# EAGLE design zeta2rework_lw_v27_rework (EAGLE 9.0.1)
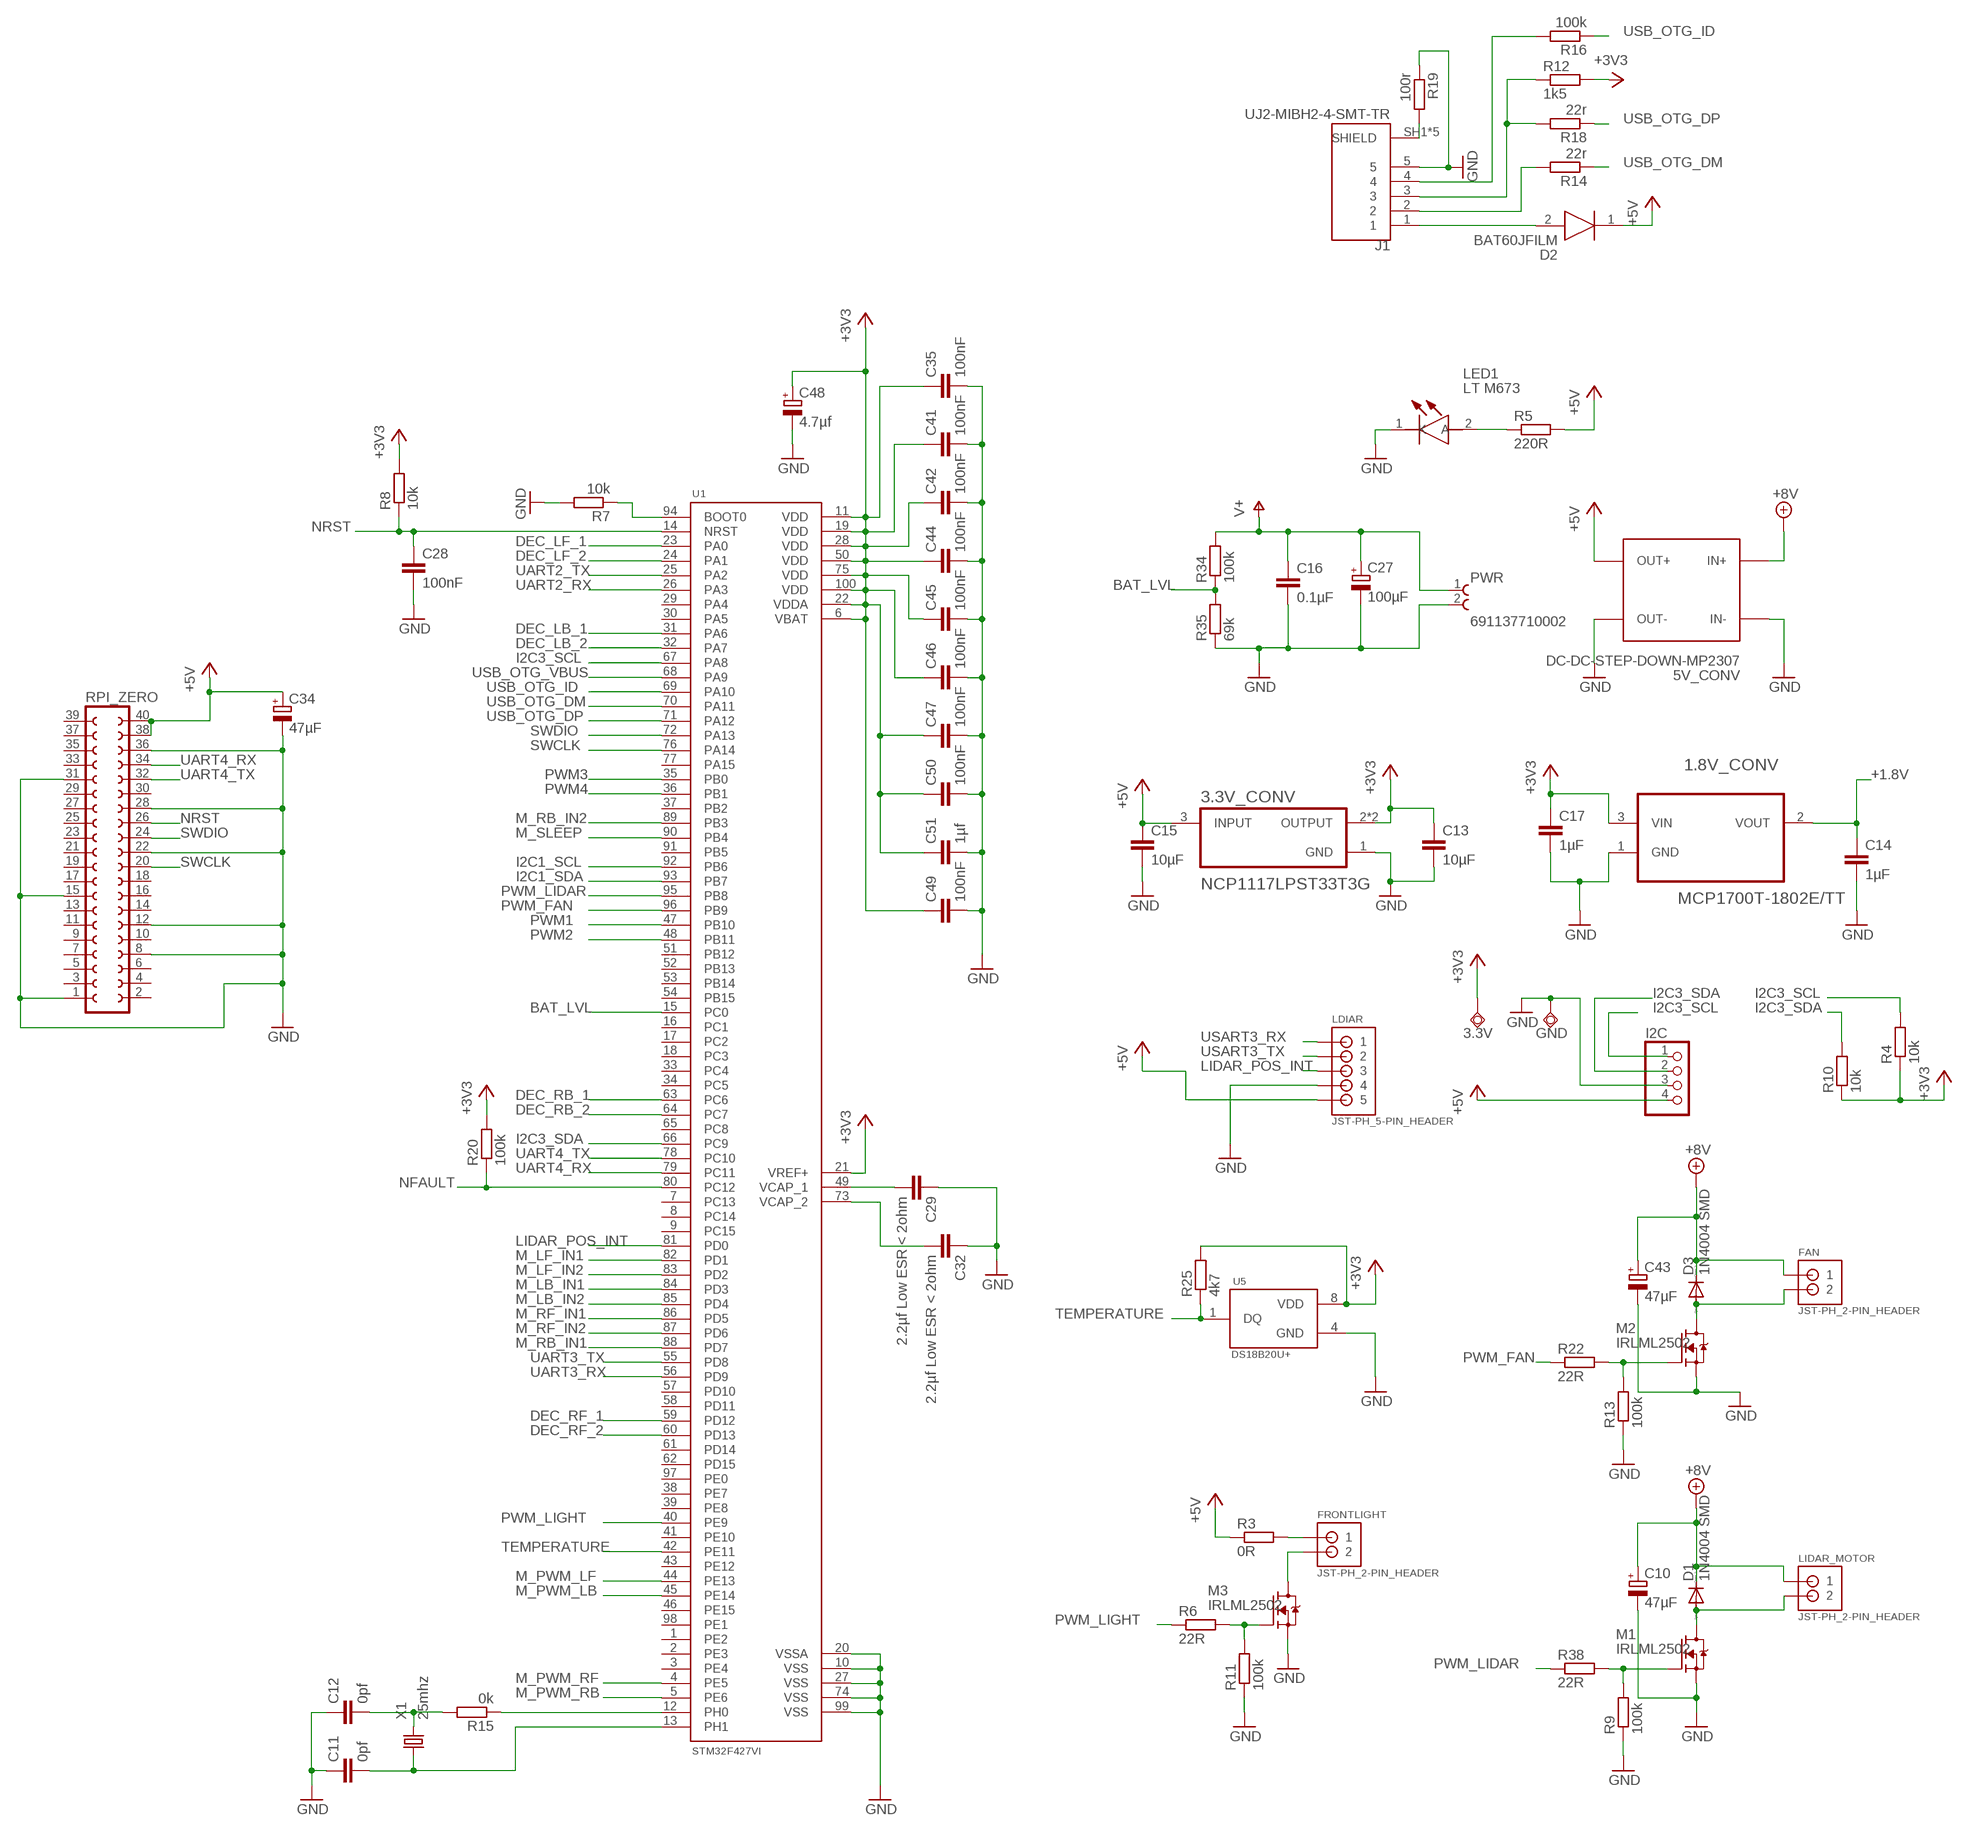
[diagram p0: schematic, sheet 1, part 1 of 2]
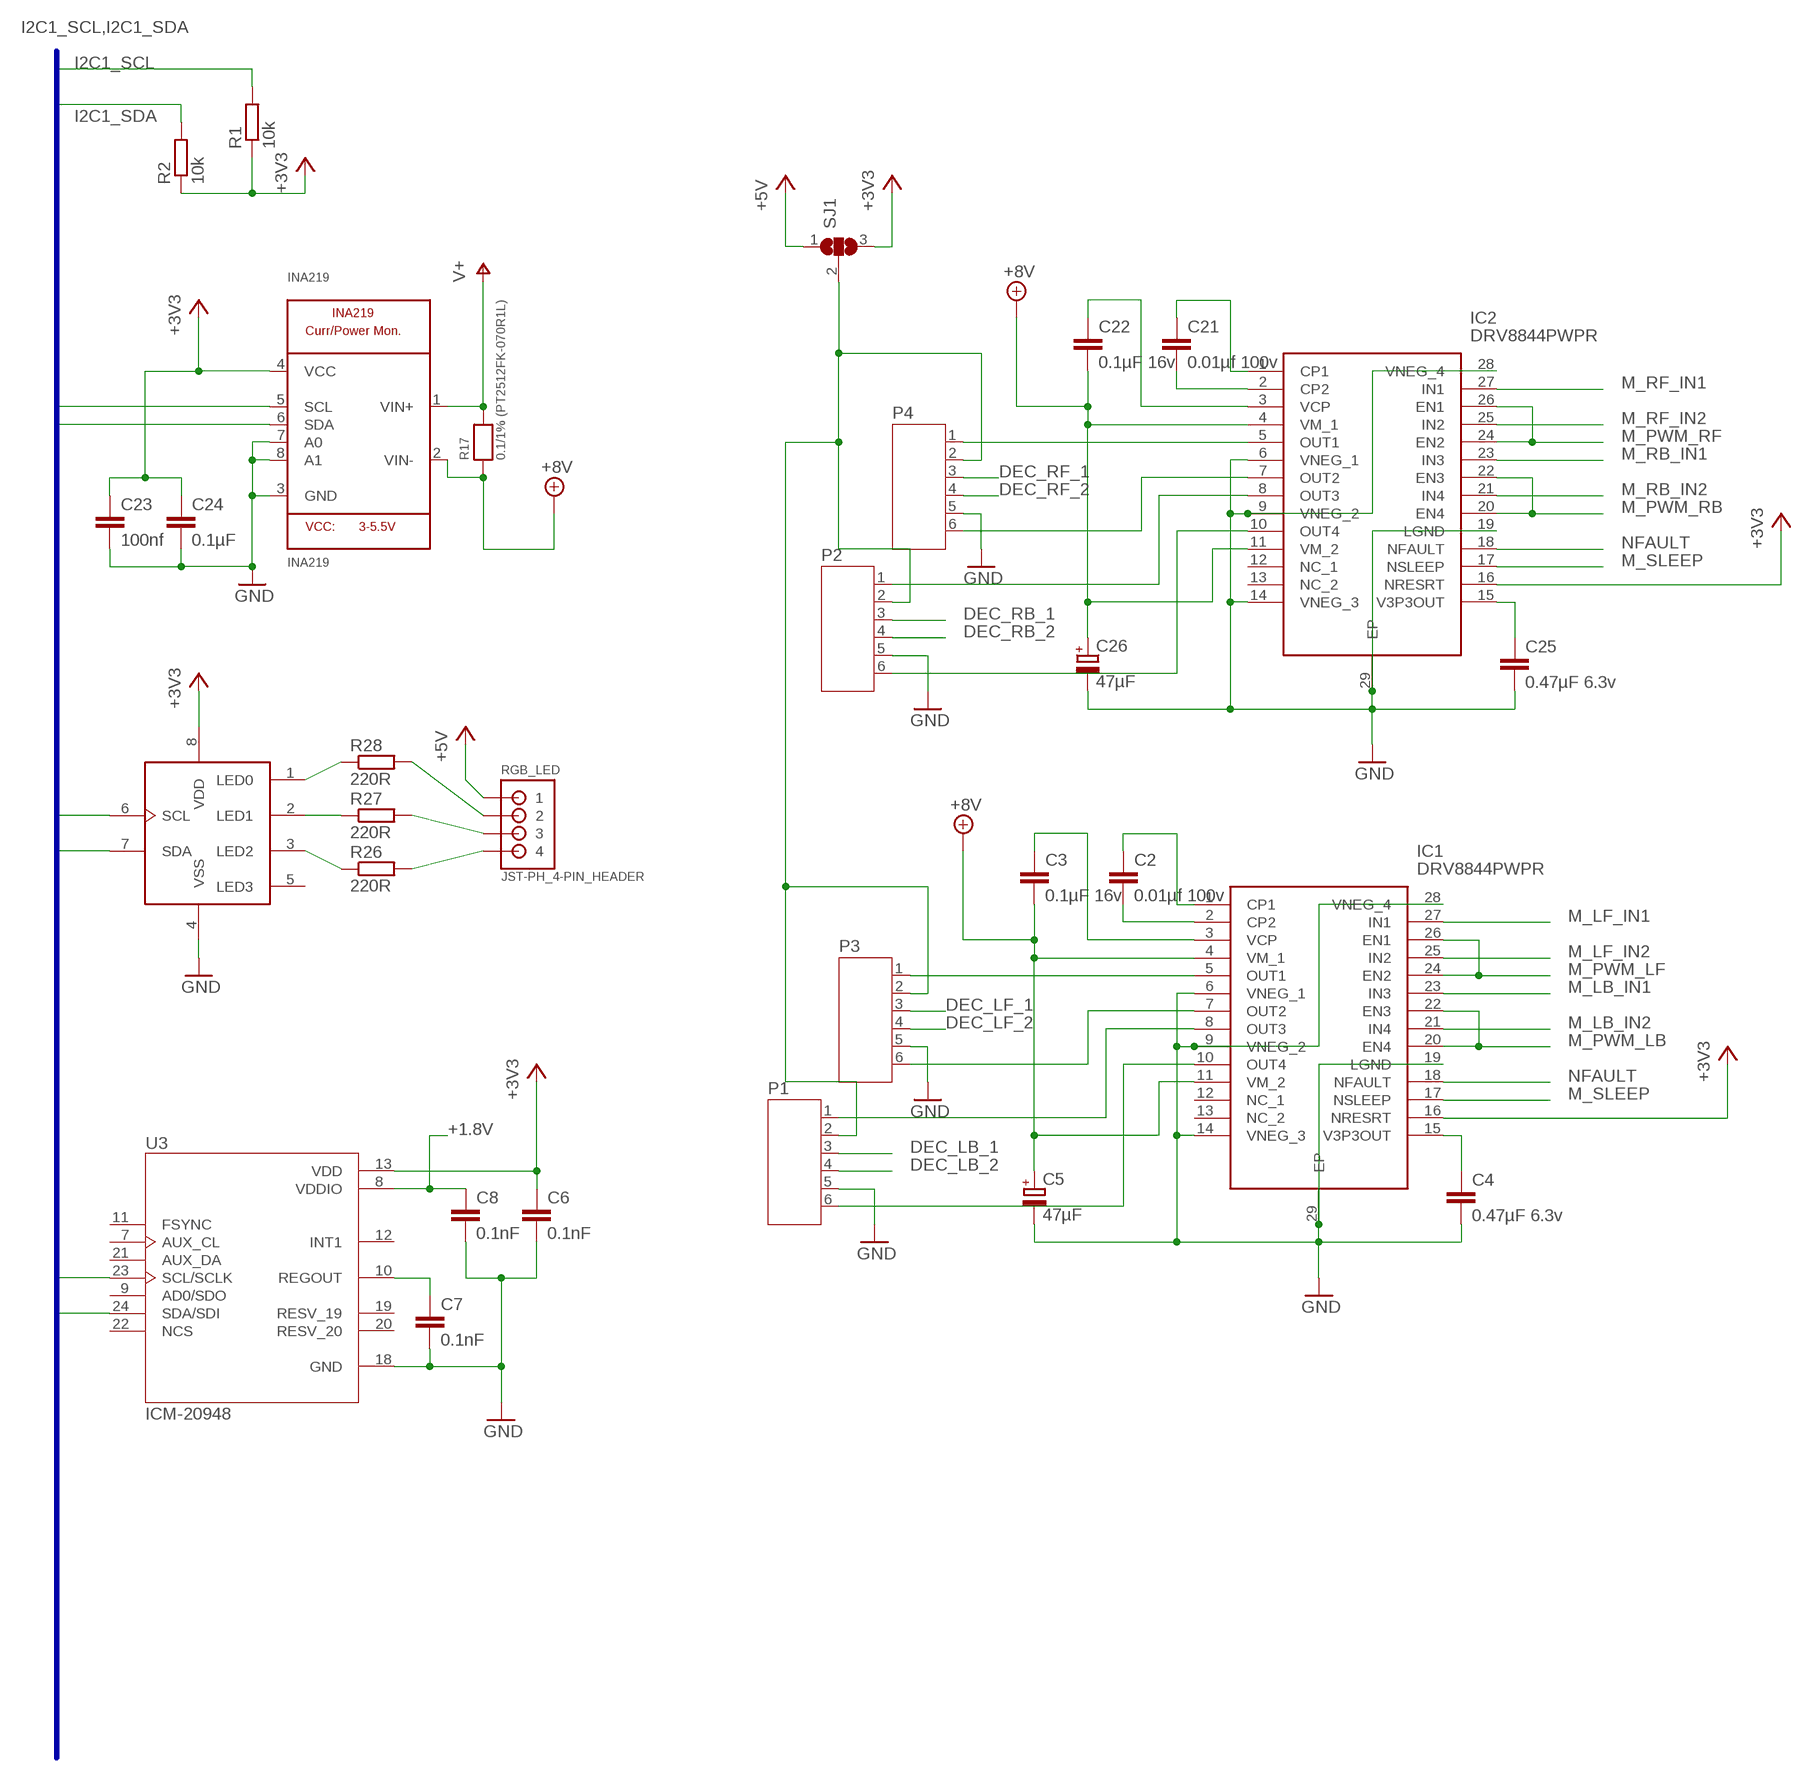
[diagram p1: schematic, sheet 1, part 2 of 2]

## Parts
1.8V_CONV  MCP1700T-1802E/TT  MCP1700T-2102E/TT  [SOT95P237X112-3N]
3.3V  TPSQTP20R  [TP20R]
3.3V_CONV  NCP1117LPST33T3G  [SOT230P700X175-4N]
5V_CONV  DC-DC-STEP-DOWN-MP2307  [DC-DC-STEP-DOWN-MP2307]
C2  0.01µf 100v  C-EUC1206  [C1206]
C3  0.1µF 16v  C-EUC1206  [C1206]
C4  0.47µF 6.3v  C-EUC1206  [C1206]
C5  47µF  CPOL-EUUD-5X5,8  [UD-5X5,8_NICHICON]
C6  0.1nF  C-EUC0603  [C0603]
C7  0.1nF  C-EUC1206  [C1206]
C8  0.1nF  C-EUC1206  [C1206]
C10  47µF  CPOL-EUUD-5X5,8  [UD-5X5,8_NICHICON]
C11  0pf  C-EUC1206  [C1206]
C12  0pf  C-EUC1206  [C1206]
C13  10µF  C-EUC1206  [C1206]
C14  1µF  C-EUC1206  [C1206]
C15  10µF  C-EUC1206  [C1206]
C16  0.1µF  C-EUC1206  [C1206]
C17  1µF  C-EUC1206  [C1206]
C21  0.01µf 100v  C-EUC1206  [C1206]
C22  0.1µF 16v  C-EUC1206  [C1206]
C23  100nf  C-EUC1206  [C1206]
C24  0.1µF  C-EUC1206  [C1206]
C25  0.47µF 6.3v  C-EUC1206  [C1206]
C26  47µF  CPOL-EUUD-5X5,8  [UD-5X5,8_NICHICON]
C27  100µF  CPOL-EUUD-5X5,8  [UD-5X5,8_NICHICON]
C28  100nF  C-EUC1206  [C1206]
C29  2.2µf Low ESR < 2ohm  C-EUC1206  [C1206]
C32  2.2µf Low ESR < 2ohm  C-EUC1206  [C1206]
C34  47µF  CPOL-EUUD-5X5,8  [UD-5X5,8_NICHICON]
C35  100nF  C-EUC1206  [C1206]
C41  100nF  C-EUC1206  [C1206]
C42  100nF  C-EUC1206  [C1206]
C43  47µF  CPOL-EUUD-5X5,8  [UD-5X5,8_NICHICON]
C44  100nF  C-EUC1206  [C1206]
C45  100nF  C-EUC1206  [C1206]
C46  100nF  C-EUC1206  [C1206]
C47  100nF  C-EUC1206  [C1206]
C48  4.7µf  CPOL-EUSMCP  [SMC_P]
C49  100nF  C-EUC1206  [C1206]
C50  100nF  C-EUC1206  [C1206]
C51  1µf  C-EUC1206  [C1206]
D1  1N4004 SMD  DIODE-DO214AC  [DO214AC]
D2  BAT60JFILM  [SOD2513X117N]
D3  1N4004 SMD  DIODE-DO214AC  [DO214AC]
FAN  JST-PH_2-PIN_HEADER  [JST_B2B-PH_HEADER]
FRONTLIGHT  JST-PH_2-PIN_HEADER  [JST_B2B-PH_HEADER]
GND  TPSQTP20R  [TP20R]
I2C  PINHD-1X4  [1X04]
IC1  DRV8844PWPR  [SOP65P640X120-29N]
IC2  DRV8844PWPR  [SOP65P640X120-29N]
INA219  INA219  [SOT23-8]
J1  UJ2-MIBH2-4-SMT-TR  [CUI_UJ2-MIBH2-4-SMT-TR]
LDIAR  JST-PH_5-PIN_HEADER  [JST_B5B-PH_HEADER]
LED1  LT M673  LT_M673-N1R2-25  [LTM673-N1R2-25]
LIDAR_MOTOR  JST-PH_2-PIN_HEADER  [JST_B2B-PH_HEADER]
M1  IRLML2502  IRLML2502TRPBF  [SOT23]
M2  IRLML2502  IRLML2502TRPBF  [SOT23]
M3  IRLML2502  IRLML2502TRPBF  [SOT23]
P1  JST-PH6  [JST-PH6]
P2  JST-PH6  [JST-PH6]
P3  JST-PH6  [JST-PH6]
P4  JST-PH6  [JST-PH6]
PCA9533  PCA9533  [SOIC8]
PWR  691137710002  [691137710002]
R1  10k  R-EU_R0603  [R0603]
R2  10k  R-EU_R0603  [R0603]
R3  0R  R-EU_R0603  [R0603]
R4  10k  R-EU_R0603  [R0603]
R5  220R  R-EU_R0603  [R0603]
R6  22R  R-EU_R0603  [R0603]
R7  10k  R-EU_R0603  [R0603]
R8  10k  R-EU_R0603  [R0603]
R9  100k  R-EU_R0603  [R0603]
R10  10k  R-EU_R0603  [R0603]
R11  100k  R-EU_R0603  [R0603]
R12  1k5  R-EU_R0603  [R0603]
R13  100k  R-EU_R0603  [R0603]
R14  22r  R-EU_R0603  [R0603]
R15  0k  R-EU_R0603  [R0603]
R16  100k  R-EU_R0603  [R0603]
R17  0.1/1% (PT2512FK-070R1L)  RESISTOR2512  [2512]
R18  22r  R-EU_R0603  [R0603]
R19  100r  R-EU_R0603  [R0603]
R20  100k  R-EU_R0603  [R0603]
R22  22R  R-EU_R0603  [R0603]
R25  4k7  R-EU_R0603  [R0603]
R26  220R  R-EU_R0603  [R0603]
R27  220R  R-EU_R0603  [R0603]
R28  220R  R-EU_R0603  [R0603]
R34  100k  R-EU_R0603  [R0603]
R35  69k  R-EU_R0603  [R0603]
R38  22R  R-EU_R0603  [R0603]
RGB_LED  JST-PH_4-PIN_HEADER  [JST_B4B-PH_HEADER]
RPI_ZERO  FE20-2  [FE20-2]
SJ1  SJ2W  [SJ_2]
U1  STM32F427VI  STM32F427VGT7  [QFP50P1600X1600X160-100N]
U3  ICM-20948  [QFN40P300X300X105-25N]
U5  DS18B20U+  [SOP65P490X95-8N]
X1  25mhz  KX-9A  [5.0X3.2_KX-9A]

## Nets
+1.8V: 1.8V_CONV.2(VOUT) C8.1 C14.1 U3.8(VDDIO)
+3V3: 1.8V_CONV.3(VIN) 3.3V.TP 3.3V_CONV.2(OUTPUT) 3.3V_CONV.4(OUTPUT) C6.1 C13.1 C17.1 C23.1 C24.1 C35.1 C41.1 C42.1 C44.1 C45.1 C46.1 C47.1 C48.+ C49.1 C50.1 C51.1 IC1.16(NRESRT) IC2.16(NRESRT) INA219.4(VCC) PCA9533.8(VDD) R1.1 R2.1 R4.1 R8.2 R10.1 R12.2 R20.2 R25.2 SJ1.3 U1.6(VBAT) U1.11(VDD) U1.19(VDD) U1.21(VREF+) U1.22(VDDA) U1.28(VDD) U1.50(VDD) U1.75(VDD) U1.100(VDD) U3.13(VDD) U5.8(VDD)
+5V: 3.3V_CONV.3(INPUT) 5V_CONV.OUT+ C15.1 C34.+ D2.1(K) I2C.4 LDIAR.P5 R3.1 R5.2 RGB_LED.P1 RPI_ZERO.38 RPI_ZERO.40 SJ1.1
+8V: 5V_CONV.IN+ C3.2 C5.+ C10.+ C22.2 C26.+ C43.+ D1.C D3.C FAN.P1 IC1.4(VM_1) IC1.11(VM_2) IC2.4(VM_1) IC2.11(VM_2) INA219.2(VIN-) LIDAR_MOTOR.P1 R17.1
BAT_LVL: R34.1 R35.2 U1.15(PC0)
DEC_LB_1: P1.3 U1.31(PA6)
DEC_LB_2: P1.4 U1.32(PA7)
DEC_LF_1: P3.3 U1.23(PA0)
DEC_LF_2: P3.4 U1.24(PA1)
DEC_RB_1: P2.3 U1.63(PC6)
DEC_RB_2: P2.4 U1.64(PC7)
DEC_RF_1: P4.3 U1.59(PD12)
DEC_RF_2: P4.4 U1.60(PD13)
GND: 1.8V_CONV.1(GND) 3.3V_CONV.1(GND) 5V_CONV.IN- 5V_CONV.OUT- C4.2 C5.- C6.2 C7.2 C8.2 C10.- C11.1 C12.1 C13.2 C14.2 C15.2 C16.2 C17.2 C23.2 C24.2 C25.2 C26.- C27.- C28.2 C29.1 C32.1 C34.- C35.2 C41.2 C42.2 C43.- C44.2 C45.2 C46.2 C47.2 C48.- C49.2 C50.2 C51.2 GND.TP I2C.3 IC1.6(VNEG_1) IC1.9(VNEG_2) IC1.14(VNEG_3) IC1.19(LGND) IC1.28(VNEG_4) IC1.29(EP) IC2.6(VNEG_1) IC2.9(VNEG_2) IC2.14(VNEG_3) IC2.19(LGND) IC2.28(VNEG_4) IC2.29(EP) INA219.3(GND) INA219.7(A0) INA219.8(A1) J1.5 LDIAR.P4 LED1.1(K) M1.2(S) M2.2(S) M3.2(S) P1.5 P2.5 P3.5 P4.5 PCA9533.4(VSS) PWR.2 R7.2 R9.1 R11.1 R13.1 R19.1 R35.1 RPI_ZERO.1 RPI_ZERO.8 RPI_ZERO.12 RPI_ZERO.15 RPI_ZERO.22 RPI_ZERO.28 RPI_ZERO.31 RPI_ZERO.36 U1.10(VSS) U1.20(VSSA) U1.27(VSS) U1.74(VSS) U1.99(VSS) U3.18(GND) U5.4(GND)
I2C1_SCL: INA219.5(SCL) PCA9533.6(SCL) R1.2 U1.92(PB6) U3.23(SCL/SCLK)
I2C1_SDA: INA219.6(SDA) PCA9533.7(SDA) R2.2 U1.93(PB7) U3.24(SDA/SDI)
I2C3_SCL: I2C.1 R4.2 U1.67(PA8)
I2C3_SDA: I2C.2 R10.2 U1.66(PC9)
LIDAR_POS_INT: LDIAR.P3 U1.81(PD0)
M_LB_IN1: IC1.23(IN3) U1.84(PD3)
M_LB_IN2: IC1.21(IN4) U1.85(PD4)
M_LF_IN1: IC1.27(IN1) U1.82(PD1)
M_LF_IN2: IC1.25(IN2) U1.83(PD2)
M_PWM_LB: IC1.20(EN4) IC1.22(EN3) U1.45(PE14)
M_PWM_LF: IC1.24(EN2) IC1.26(EN1) U1.44(PE13)
M_PWM_RB: IC2.20(EN4) IC2.22(EN3) U1.5(PE6)
M_PWM_RF: IC2.24(EN2) IC2.26(EN1) U1.4(PE5)
M_RB_IN1: IC2.23(IN3) U1.88(PD7)
M_RB_IN2: IC2.21(IN4) U1.89(PB3)
M_RF_IN1: IC2.27(IN1) U1.86(PD5)
M_RF_IN2: IC2.25(IN2) U1.87(PD6)
M_SLEEP: IC1.17(NSLEEP) IC2.17(NSLEEP) U1.90(PB4)
N$1: C21.2 IC2.2(CP2)
N$2: C21.1 IC2.1(CP1)
N$3: C22.1 IC2.3(VCP)
N$4: IC2.10(OUT4) P2.6
N$5: J1.3 R12.1 R18.2
N$6: FRONTLIGHT.P1 R3.2
N$7: LED1.2(A) R5.1
N$8: C7.1 U3.10(REGOUT)
N$9: FRONTLIGHT.P2 M3.3(D)
N$10: M3.1(G) R6.2 R11.2
N$11: IC2.5(OUT1) P4.1
N$12: IC2.7(OUT2) P4.6
N$13: C11.2 U1.13(PH1) X1.1
N$14: C12.2 R15.2 X1.3
N$15: D2.2(A) J1.1
N$16: R7.1 U1.94(BOOT0)
N$17: J1.4 R16.2
N$18: C2.2 IC1.2(CP2)
N$19: IC2.8(OUT3) P2.1
N$20: C2.1 IC1.1(CP1)
N$21: C3.1 IC1.3(VCP)
N$22: PCA9533.3(LED2) R26.1
N$23: PCA9533.2(LED1) R27.1
N$24: PCA9533.1(LED0) R28.1
N$25: IC1.5(OUT1) P3.1
N$26: C25.1 IC2.15(V3P3OUT)
N$27: IC1.7(OUT2) P3.6
N$28: IC1.8(OUT3) P1.1
N$29: C4.1 IC1.15(V3P3OUT)
N$30: IC1.10(OUT4) P1.6
N$31: R26.2 RGB_LED.P4
N$32: P1.2 P2.2 P3.2 P4.2 SJ1.2
N$33: R27.2 RGB_LED.P3
N$34: J1.2 R14.2
N$35: R28.2 RGB_LED.P2
N$36: C29.2 U1.49(VCAP_1)
N$37: M2.1(G) R13.2 R22.2
N$38: M1.1(G) R9.2 R38.2
N$39: D1.A LIDAR_MOTOR.P2 M1.3(D)
N$40: J1.SH1(SHIELD) J1.SH2(SHIELD) J1.SH3(SHIELD) J1.SH4(SHIELD) J1.SH5(SHIELD) R19.2
N$44: R15.1 U1.12(PH0)
N$45: C32.2 U1.73(VCAP_2)
N$55: D3.A FAN.P2 M2.3(D)
NFAULT: IC1.18(NFAULT) IC2.18(NFAULT) R20.1 U1.80(PC12)
NRST: C28.1 R8.1 RPI_ZERO.26 U1.14(NRST)
PWM1: U1.47(PB10)
PWM2: U1.48(PB11)
PWM3: U1.35(PB0)
PWM4: U1.36(PB1)
PWM_FAN: R22.1 U1.96(PB9)
PWM_LIDAR: R38.1 U1.95(PB8)
PWM_LIGHT: R6.1 U1.40(PE9)
SWCLK: RPI_ZERO.20 U1.76(PA14)
SWDIO: RPI_ZERO.24 U1.72(PA13)
TEMPERATURE: R25.1 U1.42(PE11) U5.1(DQ)
UART2_RX: U1.26(PA3)
UART2_TX: U1.25(PA2)
UART3_RX: U1.56(PD9)
UART3_TX: U1.55(PD8)
UART4_RX: RPI_ZERO.34 U1.79(PC11)
UART4_TX: RPI_ZERO.32 U1.78(PC10)
USART3_RX: LDIAR.P1
USART3_TX: LDIAR.P2
USB_OTG_DM: R14.1 U1.70(PA11)
USB_OTG_DP: R18.1 U1.71(PA12)
USB_OTG_ID: R16.1 U1.69(PA10)
USB_OTG_VBUS: U1.68(PA9)
V+: C16.1 C27.+ INA219.1(VIN+) PWR.1 R17.2 R34.2
Unconnected: IC1.12(NC_1) IC1.13(NC_2) IC2.12(NC_1) IC2.13(NC_2) PCA9533.5(LED3) RPI_ZERO.2 RPI_ZERO.3 RPI_ZERO.4 RPI_ZERO.5 RPI_ZERO.6 RPI_ZERO.7 RPI_ZERO.9 RPI_ZERO.10 RPI_ZERO.11 RPI_ZERO.13 RPI_ZERO.14 RPI_ZERO.16 RPI_ZERO.17 RPI_ZERO.18 RPI_ZERO.19 RPI_ZERO.21 RPI_ZERO.23 RPI_ZERO.25 RPI_ZERO.27 RPI_ZERO.29 RPI_ZERO.30 RPI_ZERO.33 RPI_ZERO.35 RPI_ZERO.37 RPI_ZERO.39 U1.1(PE2) U1.2(PE3) U1.3(PE4) U1.7(PC13) U1.8(PC14) U1.9(PC15) U1.16(PC1) U1.17(PC2) U1.18(PC3) U1.29(PA4) U1.30(PA5) U1.33(PC4) U1.34(PC5) U1.37(PB2) U1.38(PE7) U1.39(PE8) U1.41(PE10) U1.43(PE12) U1.46(PE15) U1.51(PB12) U1.52(PB13) U1.53(PB14) U1.54(PB15) U1.57(PD10) U1.58(PD11) U1.61(PD14) U1.62(PD15) U1.65(PC8) U1.77(PA15) U1.91(PB5) U1.97(PE0) U1.98(PE1) U3.7(AUX_CL) U3.9(AD0/SDO) U3.11(FSYNC) U3.12(INT1) U3.19(RESV_19) U3.20(RESV_20) U3.21(AUX_DA) U3.22(NCS)

## Buses
I2C1_SCL,I2C1_SDA

## Library data of the parts
1.8V_CONV = MCP1700T-2102E_TT:MCP1700T-2102E/TT: Low Quiescent Current LDO; AVAILABILITY: Unavailable; DESCRIPTION: 250mA CMOS LDO, Isupply 1uA and 2% VoutAccuracy; MF: Microchip; MP: MCP1700T-2102E/TT; PACKAGE: SOT-23 Microchip; PRICE: None
3.3V GND = testpad:TPSQ: Test pad
3.3V_CONV = NCP1117LPST33T3G:NCP1117LPST33T3G: None; AVAILABILITY: Unavailable; DESCRIPTION: Linear Voltage Regulator, Positive, LDO, 1.0 A _Fixed and Adjustable_ Vout: 3.3 V; MF: ON Semiconductor; MP: NCP1117LPST33T3G; PACKAGE: SOT-223 ON Semiconductor; PRICE: None
5V_CONV = diy-modules:DC-DC-STEP-DOWN-MP2307: DC/DC Step-Down Regulator based on MP2307DN chip MP2307 datasheet available here: https://cdn-shop.adafruit.com/datasheets/MP2307_r1.9.pdf Click here to find device on ebay.com <http://www.ebay.com/sch/dc+dc+3a+mini+converter>
C2-C4 C6-C8 C11-C17 C21-C25 C28 C29 C32 C35 C41 C42 C44-C47 C49-C51 = rcl:C-EU: CAPACITOR, European symbol; SPICEPREFIX: C
C5 C10 C26 C27 C34 C43 C48 = rcl:CPOL-EU: POLARIZED CAPACITOR, European symbol; SPICEPREFIX: C
D1 D3 = diode:DIODE-: DIODE
D2 = BAT60JFILM:BAT60JFILM: BAT60JFILM, Schottky Diode, 3A max, 10V, 2-Pin, SOD-323 Source: Datasheet <http://www.st.com/web/en/resource/technical/document/datasheet/CD00001944.pdf>; ALLIED_NUMBER: 70389806; ALLIED_PRICE-STOCK: http://www.alliedelec.com/stmicroelectronics-bat60jfilm/70389806/; DESCRIPTION: BAT60JFILM, Schottky Diode, 3A max, 10V, 2-Pin, SOD-323; HEIGHT: 1.17mm; MANUFACTURER_NAME: STMicroelectronics; MANUFACTURER_PART_NUMBER: BAT60JFILM; MOUSER_PART_NUMBER: 511-BAT60JFILM; MOUSER_PRICE-STOCK: https://www.mouser.com/Search/Refine.aspx?Keyword=511-BAT60JFILM; RS_PART_NUMBER: 1458781; RS_PRICE-STOCK: http://uk.rs-online.com/web/p/products/1458781
FAN FRONTLIGHT LIDAR_MOTOR = srg:JST-PH_2-PIN_HEADER: 2-pin JST PH Shrouded Header, top entry P/N B2B-PH-K-S Mating connector PHR-2 Mating cable assembly: Sparkfun PRT-09914 <http://www.sparkfun.com/products/9914>
I2C = pinhead:PINHD-1X4: PIN HEADER
IC1 IC2 = DRV8844PWPR:DRV8844PWPR: 5A Brushed DC motor or Quad 1.75A Solenoid/Relay Driver with +/-30V split supply support (PWM Ctrl) Source: Datasheet <http://www.ti.com/lit/ds/symlink/drv8844.pdf>; DESCRIPTION: 5A Brushed DC motor or Quad 1.75A Solenoid/Relay Driver with +/-30V split supply support (PWM Ctrl); HEIGHT: 1.2mm; MANUFACTURER_NAME: Texas Instruments; MANUFACTURER_PART_NUMBER: DRV8844PWPR; MOUSER_PART_NUMBER: 595-DRV8844PWPR; MOUSER_PRICE-STOCK: https://www.mouser.com/Search/Refine.aspx?Keyword=595-DRV8844PWPR
INA219 = INA219:INA219: INA219 - I2C Current/Power Monitor Voltage Range: 0-26V Accuracy: 0.5% Temperature: -40°C - 125°C; AVAILABILITY: Unavailable; DESCRIPTION: the ina219 is a high-side current shunt and power monitor with an i2c interface. the ina219 monitors both shunt drop ...; MF: Texas Instruments; MP: INA219; PACKAGE: None; PRICE: None
J1 = UJ2-MIBH2-4-SMT-TR:UJ2-MIBH2-4-SMT-TR: Micro B Type 5 Pin Horizontal 30 µin Plating SMT USB Jack 2.0; AVAILABILITY: Unavailable; CUI_PURCHASE_URL: https://www.cui.com/product/interconnect/usb-connectors/micro-b/uj2-mibh2-4-smt?utm_source=snapeda.com&utm_medium=referral&utm_campaign=snapedaBOM; DESCRIPTION: Micro B Type 5 Pin Horizontal 30 µin Plating SMT USB Jack 2.0; MF: CUI Inc.; MP: UJ2-MIBH2-4-SMT-TR; PACKAGE: None; PRICE: None
LDIAR = srg:JST-PH_5-PIN_HEADER: 5-pin JST PH Shrouded Header, top entry P/N B5B-PH-K-S Mating connector PHR-5 Mating cable assembly: Sparkfun PRT-09917 <http://www.sparkfun.com/products/9917>
LED1 = LT_M673-N1R2-25:LT_M673-N1R2-25: Osram Opto LT M673-N1R2-25, Mini TOPLED Series Green LED, 529 nm,, Rectangle Lens SMD Package Source: Datasheet <https://www.osram-os.com/Graphics/XPic0/00252812_0.pdf/LT M673.pdf>; DESCRIPTION: Osram Opto LT M673-N1R2-25, Mini TOPLED Series Green LED, 529 nm,, Rectangle Lens SMD Package; HEIGHT: mm; MANUFACTURER_NAME: OSRAM Opto Semiconductors; MANUFACTURER_PART_NUMBER: LT M673-N1R2-25; MOUSER_PART_NUMBER: 720-LTM673N1R225Z; MOUSER_PRICE-STOCK: https://www.mouser.com/Search/Refine.aspx?Keyword=720-LTM673N1R225Z; RS_PART_NUMBER: 9133231; RS_PRICE-STOCK: http://uk.rs-online.com/web/p/products/9133231
M1-M3 = IRLML2502TRPBF:IRLML2502TRPBF; AVAILABILITY: Unavailable; DESCRIPTION: Single N-Channel 20 V 0.08 Ohm 12 nC 1.25 W Silicon SMT Mosfet - SOT-23; MF: Infineon; MP: IRLML2502TRPBF; PACKAGE: SOT-23-3 Infineon; PRICE: None
P1-P4 = jst-ph:JST-PH6
PCA9533 = adam - ics:PCA9533: PCA9533D/01: LED driver and dimmer 4 channel, PWM @ 8 bit resolution 25mA / channel sink external resistors per LED I2C protocol @ 400kHz (fast) digikey: 568-3372-5-ND, 8-SOIC, $1.92
PWR = term block:691137710002: SERIE 1377 - 5.00 MM - HORIZONTAL CABLE ENTRY WITH PRESSURE CLAMP - GLOW WIRE PLASTIC - WR-TBL <http://katalog.we-online.de/media/images/v2/Family_WR-TBL1_6911377100xx.jpg> Details see: http://katalog.we-online.de/en/em/TBL_5_00_1377_HORIZONTAL_ENTRY_W_PRESSURE_CLAMP_GLOW_WIRE_6911377100xx Created by Yingchun,Shan 2016(C) Wurth Elektronik; AVAILABILITY: Unavailable; DESCRIPTION: Term Block 2pos Side Entry 5mm; MF: Wurth Electronics; MP: 691137710002; PACKAGE: None; PRICE: None
R1-R16 R18-R20 R22 R25-R28 R34 R35 R38 = rcl:R-EU_: RESISTOR, European symbol; SPICEPREFIX: R
R17 = microbuilder:RESISTOR: Resistors 0402 - 0402 Surface Mount Package 22 Ohm 1% 1/16W [Digikey: 311-22.0LRTR-ND] 33 Ohm 5% 1/16W 1.0K 5% 1/16W 1.5K 5% 1/16W 2.0K 1% 1/16W 10.0K 1% 1/16W [Digikey: 311-10.0KLRTR-ND] 10.0K 5% 1/16W [Digikey: RMCF0402JT10K0TR-ND] 12.1K 1% 1/16W [Digikey: 311-22.0LRTR-ND] 100.0K 5% 1/16W 0603 - 0603 Surface Mount Package 0 Ohm 1/10 Watt 1% Resistor 15 Ohm 1/10 Watt 1% Resistor 33 Ohm 1/10 Watt 1% Resistor 49.9 Ohm 1/10 Watt 1% Resistor 100 Ohm 1/10 Watt 1% Resistor 150 Ohm 1/10 Watt 1% Resistor 240 Ohm 1/10 Watt 1% Resistor 390 Ohm 1/10 Watt 1% Resistor 560 Ohm 1/10 Watt 1% Resistor 680 Ohm 1/10 Watt 1% Resistor 750 Ohm 1/10 Watt 1% Resistor 1.0K Ohm 1/10 Watt 1% Resistor 1.5K Ohm 1/10 Watt 1% Resistor 2.0K Ohm 1/10 Watt 1% Resistor 2.2K Ohm 1/10 Watt 1% Resistor 3.3K Ohm 1/10 Watt 1% Resistor 4.7K Ohm 1/10 Watt 1% Resistor 10.0K Ohm 1/10 Watt 1% Resistor 12.0K Ohm 1/10 Watt 1% Resistor 12.1K Ohm 1/10 Watt 1% Resistor 20.0K Ohm 1/10 Watt 1% Resistor 33.0K Ohm 1/10 Watt 1% Resistor 100.0K Ohm 1/10 Watt 1% Resistor 0805 - 0805 Surface Mount Package 0 Ohm 1/8 Watt 1% Resistor 33 Ohm 1/8 Watt 1% Resistor 100 Ohm 1/8 Watt 1% Resistor 150 Ohm 1/8 Watt 1% Resistor 200 Ohm 1/8 Watt 1% Resistor 240 Ohm 1/8 Watt 1% Resistor 330 Ohm 1/8 Watt 1% Resistor 390 Ohm 1/8 Watt 1% Resistor 470 Ohm 1/8 Watt 1% Resistor 1.0K Ohm 1/8 Watt 1% Resistor 1.5K Ohm 1/8 Watt 1% Resistor 2.0K Ohm 1/8 Watt 1% Resistor 4.7K Ohm 1/8 Watt 1% Resistor 5.1K Ohm 1/8 Watt 1% Resistor 5.6K Ohm 1/8 Watt 1% Resistor 10.0K Ohm 1/8 Watt 1% Resistor 22.0K Ohm 1/8 Watt 1% Resistor 33.0K Ohm 1/8 Watt 1% Resistor 100K Ohm 1/8 Watt 1% Resistor 1206 - 1206 Surface Mount Package 2012 - 2010 Surface Mount Package 0.11 Ohm 1/2 Watt 1% Resistor - Digikey: RHM.11UCT-ND
RGB_LED = srg:JST-PH_4-PIN_HEADER: 4-pin JST PH Shrouded Header, top entry P/N B4B-PH-K-S Mating connector PHR-4 Mating cable assembly: Sparkfun PRT-09916 <http://www.sparkfun.com/products/9916>
RPI_ZERO = con-lsta:FE20-2: FEMALE HEADER; OC_FARNELL: unknown; OC_NEWARK: unknown
SJ1 = jumper:SJ2W: SMD solder JUMPER
U1 = STM32F427VGT7:STM32F427VGT7: MCU 32-bit STM32F ARM Cortex M4 RISC 1024KB Flash 2.5V/3.3V 100-Pin LQFP Tray; AVAILABILITY: Unavailable; DESCRIPTION: Ic Mcu 32bit 1mb Flash 100lqfp; MF: STMicroelectronics; MP: STM32F427VGT7; PACKAGE: LQFP-100 STMicroelectronics; PRICE: None
U3 = ICM-20948:ICM-20948: Axis=3 Axis Gyro+3 Axis Accel+Compass. Pin For Pin With m; AVAILABILITY: Unavailable; DESCRIPTION: 9 Axis=3 Axis Gyro+3 Axis Accel+Compass. Pin For Pin With m; MF: TDK InvenSense; MP: ICM-20948; PACKAGE: QFN-24 InvenSense; PRICE: None
U5 = DS18B20U_:DS18B20U+: Board Mount Temperature Sensors Prgmble Resolution 1-Wire Parasite Pwr; AVAILABILITY: Unavailable; DESCRIPTION: Date Code: 1043+; RoHS Compliant: Yes;; MF: Maxim; MP: DS18B20U+; PACKAGE: TSSOP-8 Chip Coolers; PRICE: None
X1 = crystal-geyer_V1_0:KX: Quartz Crystals (MHz) SMD: KX - Serie Model Size l/w/h [mm] Frequency Range Frequency Stability Temp. Range [°C] Load Capacitance AECQ 200 availabel Datasheet KX-4 KX-5 KX-6 KX-7 KX-9A KX-9B KX-12A KX-12B KX-13 KX-20 KX-K KX-KS 1.6/1.2/0.3 2.0/1.6/0.45 2.5/2.0/0.55 3.2/2.5/0.8 5.0/3.2/1.0 5.0/3.2/1.1 6.0/3.5/1.1 6.0/3.5/1.0 7.0/5.0 /1.3 11.6/5.5/1.6 12.3/4.5/4.2 12.3/4.5/3.2 24.0 ~ 80.0 MHz 16.0 ~ 80.0 MHz 12.0 ~ 80.0 MHz 8.0 ~ 60.0 MHz 7,68 ~ 300,0 MHz 8,0 ~ 50,0 MHz 8,0 ~ 150,0 MHz 8,0 ~ 50,0 MHz 6,0 ~ 160,0 MHz 3,579 ~ 25,0 MHz 3,579 ~ 70,0 MHz 3,579 ~ 70,0 MHz ±10 … ±50ppm ±10 … ±50ppm ±10 … ±50ppm ±10 … ±50ppm ±10 … ±50ppm ±10 … ±50ppm ±10 … ±50ppm ±10 … ±50ppm ±10 … ±50ppm ±50ppm ±10 … ±50ppm ±10 … ±50ppm (*) -40°C …+85°C (*) -40°C …+125°C (*) -40°C …+125°C (*) -40°C …+125°C (*) -40°C …+105°C (*) -40°C …+105°C (*) -40°C …+125°C (*) -40°C …+105°C (*) -40°C …+105°C (*) -40°C …+105°C (*) -40°C …+85°C (*) -40°C …+85°C 8, 8…16 8, 8…16 10, 8…16 12, 7…20 16, 10…20 16, 10…20 16, 10…20 16, 12…20 16, 12…20 16, 12…20 16, 12…30 16, 12…30 - yes yes yes - - - - - - - - KX-4.pdf <http://www.geyer-electronic.de/uploads/tx_userartikelfrequenz/GEYER-KX-4.pdf> KX-5.pdf <http://www.geyer-electronic.de/uploads/tx_userartikelfrequenz/GEYER-KX-5.pdf> KX-6.pdf <http://www.geyer-electronic.de/uploads/tx_userartikelfrequenz/GEYER-KX-6.pdf> KX-7.pdf <http://www.geyer-electronic.de/uploads/tx_userartikelfrequenz/GEYER-KX-7.pdf> KX-9A.pdf <http://www.geyer-electronic.de/uploads/tx_userartikelfrequenz/GEYER-KX-9A.pdf> KX-9B.pdf <http://www.geyer-electronic.de/uploads/tx_userartikelfrequenz/GEYER-KX-9B.pdf> KX-12A.pdf <http://www.geyer-electronic.de/uploads/tx_userartikelfrequenz/GEYER-KX-12A.pdf> KX-12B.pdf <http://www.geyer-electronic.de/uploads/tx_userartikelfrequenz/GEYER-KX-12B.pdf> KX-13.pdf <http://www.geyer-electronic.de/uploads/tx_userartikelfrequenz/GEYER-KX-13.pdf> KX-20.pdf <http://www.geyer-electronic.de/uploads/tx_userartikelfrequenz/GEYER-KX-20.pdf> KX-K.pdf <http://www.geyer-electronic.de/uploads/tx_userartikelfrequenz/GEYER-KX-K.pdf> KX-KS.pdf <http://www.geyer-electronic.de/uploads/tx_userartikelfrequenz/GEYER-KX-KS.pdf> <http://www.geyer-electronic.de/fileadmin/template/img/logo-geyer-electronic.png> Details see: http://www.geyer-electronic.de/Frequenz-Produkte.9.0.html Created 2016-06-07, Hans Locher 2016 (C) Geyer Quartz Technology KX4,KX5,KX6,KX7,KX9A,KX9B,KX12A,KX12B,KX13,KX20,KXK,KXKS;1612;2016;2520;3225;5032;6035;7050;11655;12345;1,6x1,2;2,0x1,6;2,5x2,0;3,2x2,5;5,0x3,2;6,0x3,5;7,0x5,0;11,6x5,5;12,3x4,5;12,3x4,5;1.6x1.2;2.0x1.6;2.5x2.0;3.2x2.5;5.0x3.2;6.0x3.5;7.0x5.0;11.6x5.5;12.3x4.5;12.3x4.5;

## Net classes
0 default: clearance 0.152 mm

## Board
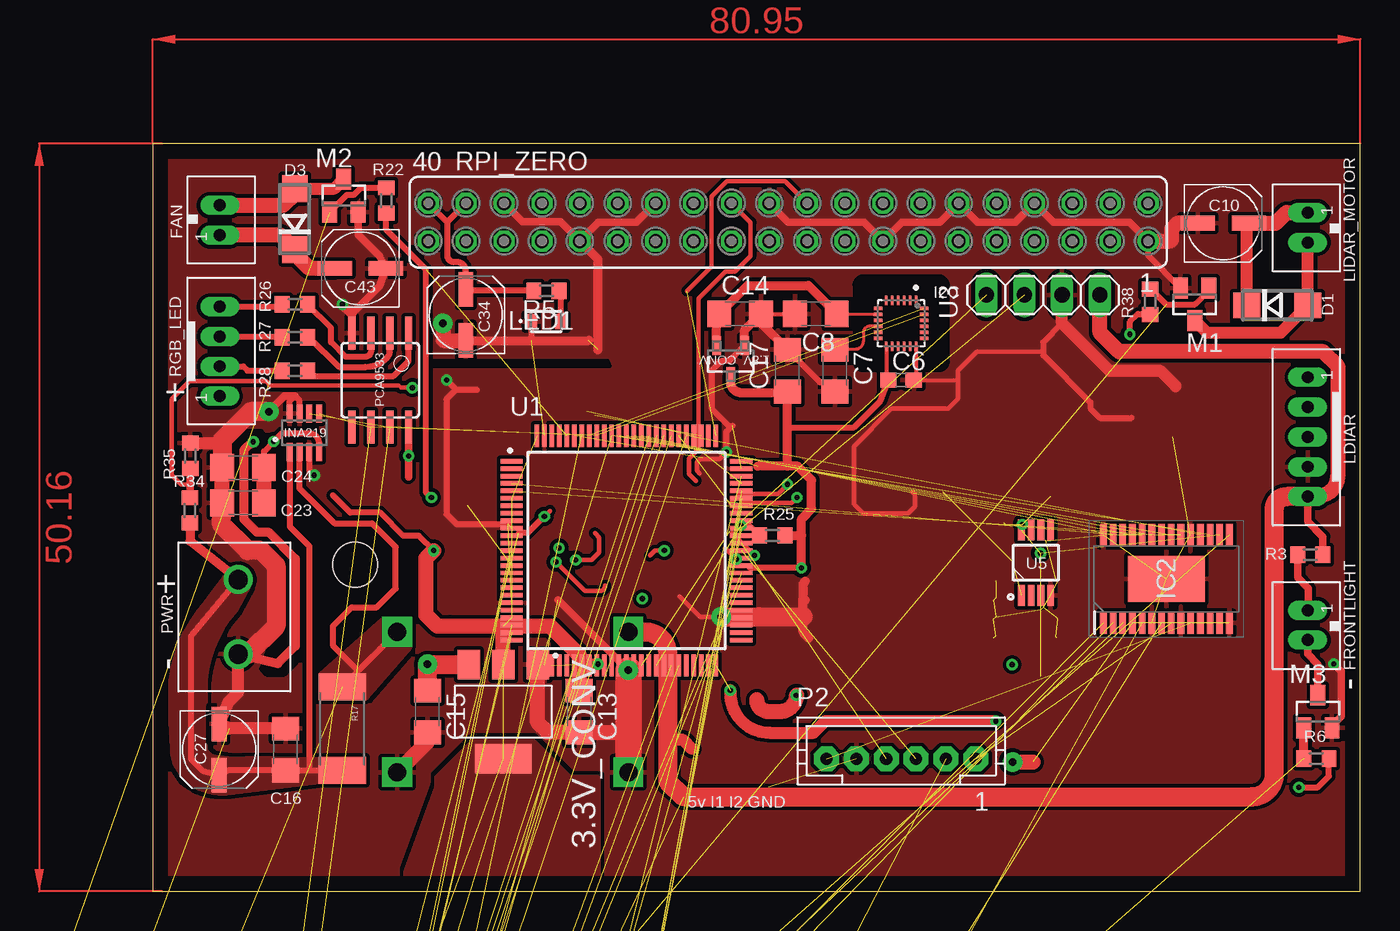
[diagram p2: board, top side]
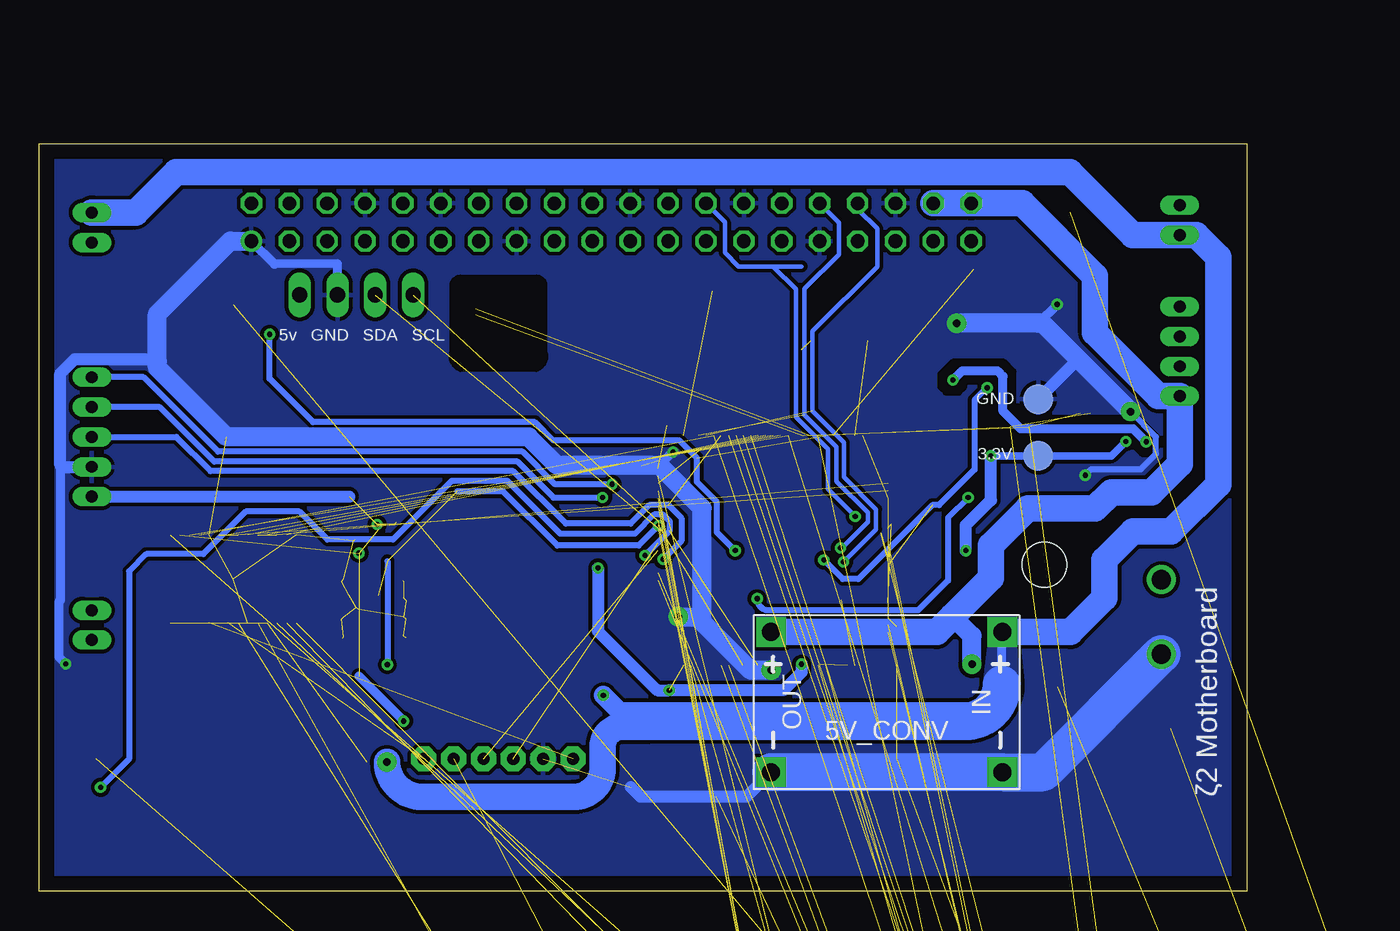
[diagram p3: board, bottom side, seen from below]

Size 80.95 x 50.16 mm. Coordinates in mm from the lower left corner, seen from the top.
Outline: 0,0 80.95,0 80.95,50.16 0,50.16 0,0
Copper layers (1*16): Top 0.035mm / dielectric 1.5mm / Bottom 0.035mm
Design rules "default": minimum track width 6mil, minimum drill 0.35mm, track to track 6mil, track to pad 6mil, pad to pad 6mil, via to via 6mil, smd to smd 6mil, copper to edge 40mil, drill to drill 6mil, minimum pad ring 10mil, minimum via ring 8mil, stop-mask expansion 4mil, vias tented up to drill 0mil, thermal gap 10mil
Holes 3 mm at 13.56,21.92

### Footprints (pad centres in the part's own frame; a part is rotated, then mirrored left to right if it is on the bottom)
SOT95P237X112-3N = smd 0.559 x 1.27: 1 -0.94,-1.041; 2 0.94,-1.041; 3 0,1.041
TP20R = smd 2 x 2: TP 0,0
SOT230P700X175-4N = smd 2 x 1.5: 1 -3.15,2.3; 2 -3.15,0; 3 -3.15,-2.3 | smd 2 x 3.8: 4 3.15,0
DC-DC-STEP-DOWN-MP2307 = drill 1.2 pad 2 square: IN+ -7.747,-4.699; IN- -7.747,4.699; OUT+ 7.747,-4.699; OUT- 7.747,4.699
C1206 = smd 1.6 x 1.8: 1 -1.4,0; 2 1.4,0
UD-5X5,8_NICHICON = smd 2.3 x 1: + 1.725,0; - -1.7,0
C0603 = smd 1.1 x 1: 1 -0.85,0; 2 0.85,0
SMC_P = smd 1.6 x 1.4: + -1.575,0; - 1.575,0
DO214AC = smd 1.8 x 1.7: A 2.05,0; C -2.05,0
SOD2513X117N = smd 1.085 x 0.55: 1 -1.14,0; 2 1.14,0
JST_B2B-PH_HEADER = drill 0.8 long: P1 1.075,0.048; P2 -0.925,0.048
1X04 = drill 1.016 long: 1 -3.81,0; 2 -1.27,0; 3 1.27,0; 4 3.81,0
SOP65P640X120-29N = smd 1.475 x 0.45: 1 -2.938,4.225; 2 -2.938,3.575; 3 -2.938,2.925; 4 -2.938,2.275; 5 -2.938,1.625; 6 -2.938,0.975; 7 -2.938,0.325; 8 -2.938,-0.325; 9 -2.938,-0.975; 10 -2.938,-1.625; 11 -2.938,-2.275; 12 -2.938,-2.925; 13 -2.938,-3.575; 14 -2.938,-4.225; 15 2.938,-4.225; 16 2.938,-3.575; 17 2.938,-2.925; 18 2.938,-2.275; 19 2.938,-1.625; 20 2.938,-0.975; 21 2.938,-0.325; 22 2.938,0.325; 23 2.938,0.975; 24 2.938,1.625; 25 2.938,2.275; 26 2.938,2.925; 27 2.938,3.575; 28 2.938,4.225 | smd 3.1 x 5.18: 29 0,0
SOT23-8 = smd 0.4 x 1.2: 1 -0.975,-1.3; 2 -0.325,-1.3; 3 0.325,-1.3; 4 0.975,-1.3; 5 0.975,1.3; 6 0.325,1.3; 7 -0.325,1.3; 8 -0.975,1.3
CUI_UJ2-MIBH2-4-SMT-TR = smd 0.4 x 1.2: 1 -1.3,2.1; 2 -0.65,2.1; 3 0,2.1; 4 0.65,2.1; 5 1.3,2.1 | drill 0.6 pad 1.2 long: SH1 -3.5,0.55; SH4 3.5,0.55 | drill 0.65 pad 1.1 long: SH2 -2.225,2.65; SH3 2.225,2.65 | smd 3 x 0.9: SH5 0,0.55
JST_B5B-PH_HEADER = drill 0.8 long: P1 4,0.048; P2 2,0.048; P3 0,0.048; P4 -2,0.048; P5 -4,0.048
LTM673-N1R2-25 = smd 0.8 x 1: 1 -1,0; 2 1,0
SOT23 = smd 1 x 1.4: 1 -0.95,-1.1; 2 0.95,-1.1; 3 0,1.1
JST-PH6 = drill 0.813 pad 1.676 octagon: 1 5,0; 2 3,0; 3 1,0; 4 -1,0; 5 -3,0; 6 -5,0
SOIC8 = smd 0.5 x 2.2: 1 -1.905,-3.154; 2 -0.645,-3.154; 3 0.625,-3.154; 4 1.895,-3.154; 5 1.905,3.154; 6 0.635,3.154; 7 -0.635,3.154; 8 -1.905,3.154
691137710002 = drill 1.3: 1 -2.5,0; 2 2.5,0
R0603 = smd 1 x 1.1: 1 -0.85,0; 2 0.85,0
2512 = smd 1.8 x 3.2: 1 -2.8,0; 2 2.8,0
JST_B4B-PH_HEADER = drill 0.8 long: P1 2.98,0.048; P2 0.98,0.048; P3 -1.02,0.048; P4 -3.02,0.048
FE20-2 = drill 0.914: 1 -24.13,1.27 | drill 0.914 octagon: 2 -24.13,-1.27; 3 -21.59,1.27; 4 -21.59,-1.27; 5 -19.05,1.27; 6 -19.05,-1.27; 7 -16.51,1.27; 8 -16.51,-1.27; 9 -13.97,1.27; 10 -13.97,-1.27; 11 -11.43,1.27; 12 -11.43,-1.27; 13 -8.89,1.27; 14 -8.89,-1.27; 15 -6.35,1.27; 16 -6.35,-1.27; 17 -3.81,1.27; 18 -3.81,-1.27; 19 -1.27,1.27; 20 -1.27,-1.27; 21 1.27,1.27; 22 1.27,-1.27; 23 3.81,1.27; 24 3.81,-1.27; 25 6.35,1.27; 26 6.35,-1.27; 27 8.89,1.27; 28 8.89,-1.27; 29 11.43,1.27; 30 11.43,-1.27; 31 13.97,1.27; 32 13.97,-1.27; 33 16.51,1.27; 34 16.51,-1.27; 35 19.05,1.27; 36 19.05,-1.27; 37 21.59,1.27; 38 21.59,-1.27; 39 24.13,1.27; 40 24.13,-1.27
SJ_2 = smd 1.168 x 1.6: 1 -1.524,0; 2 0,0; 3 1.524,0
QFP50P1600X1600X160-100N = smd 1.5 x 0.3: 1 -7.7,6; 2 -7.7,5.5; 3 -7.7,5; 4 -7.7,4.5; 5 -7.7,4; 6 -7.7,3.5; 7 -7.7,3; 8 -7.7,2.5; 9 -7.7,2; 10 -7.7,1.5; 11 -7.7,1; 12 -7.7,0.5; 13 -7.7,0; 14 -7.7,-0.5; 15 -7.7,-1; 16 -7.7,-1.5; 17 -7.7,-2; 18 -7.7,-2.5; 19 -7.7,-3; 20 -7.7,-3.5; 21 -7.7,-4; 22 -7.7,-4.5; 23 -7.7,-5; 24 -7.7,-5.5; 25 -7.7,-6; 51 7.7,-6; 52 7.7,-5.5; 53 7.7,-5; 54 7.7,-4.5; 55 7.7,-4; 56 7.7,-3.5; 57 7.7,-3; 58 7.7,-2.5; 59 7.7,-2; 60 7.7,-1.5; 61 7.7,-1; 62 7.7,-0.5; 63 7.7,0; 64 7.7,0.5; 65 7.7,1; 66 7.7,1.5; 67 7.7,2; 68 7.7,2.5; 69 7.7,3; 70 7.7,3.5; 71 7.7,4; 72 7.7,4.5; 73 7.7,5; 74 7.7,5.5; 75 7.7,6 | smd 0.3 x 1.5: 26 -6,-7.7; 27 -5.5,-7.7; 28 -5,-7.7; 29 -4.5,-7.7; 30 -4,-7.7; 31 -3.5,-7.7; 32 -3,-7.7; 33 -2.5,-7.7; 34 -2,-7.7; 35 -1.5,-7.7; 36 -1,-7.7; 37 -0.5,-7.7; 38 0,-7.7; 39 0.5,-7.7; 40 1,-7.7; 41 1.5,-7.7; 42 2,-7.7; 43 2.5,-7.7; 44 3,-7.7; 45 3.5,-7.7; 46 4,-7.7; 47 4.5,-7.7; 48 5,-7.7; 49 5.5,-7.7; 50 6,-7.7; 76 6,7.7; 77 5.5,7.7; 78 5,7.7; 79 4.5,7.7; 80 4,7.7; 81 3.5,7.7; 82 3,7.7; 83 2.5,7.7; 84 2,7.7; 85 1.5,7.7; 86 1,7.7; 87 0.5,7.7; 88 0,7.7; 89 -0.5,7.7; 90 -1,7.7; 91 -1.5,7.7; 92 -2,7.7; 93 -2.5,7.7; 94 -3,7.7; 95 -3.5,7.7; 96 -4,7.7; 97 -4.5,7.7; 98 -5,7.7; 99 -5.5,7.7; 100 -6,7.7
QFN40P300X300X105-25N = smd 0.64 x 0.22: 1 -1.545,1; 2 -1.545,0.6; 3 -1.545,0.2; 4 -1.545,-0.2; 5 -1.545,-0.6; 6 -1.545,-1; 13 1.545,-1; 14 1.545,-0.6; 15 1.545,-0.2; 16 1.545,0.2; 17 1.545,0.6; 18 1.545,1 | smd 0.22 x 0.64: 7 -1,-1.545; 8 -0.6,-1.545; 9 -0.2,-1.545; 10 0.2,-1.545; 11 0.6,-1.545; 12 1,-1.545; 19 1,1.545; 20 0.6,1.545; 21 0.2,1.545; 22 -0.2,1.545; 23 -0.6,1.545; 24 -1,1.545
SOP65P490X95-8N = smd 1.4 x 0.45: 1 -2.2,0.975; 2 -2.2,0.325; 3 -2.2,-0.325; 4 -2.2,-0.975; 5 2.2,-0.975; 6 2.2,-0.325; 7 2.2,0.325; 8 2.2,0.975
5.0X3.2_KX-9A = smd 1.6 x 1.25: 1 -1.85,-1.1; 2 1.85,-1.1; 3 1.85,1.1; 4 -1.85,1.1

### Placement (x,y rotation side)
1.8V_CONV  38.73,35.56 180 top
3.3V  13.97,29.21 0 bottom
3.3V_CONV  23.5,12.07 270 top
5V_CONV  24.13,12.7 180 bottom
C2  -27.94,-212.73 0 top  (outside the outline)
C3  -16.51,-212.73 0 top  (outside the outline)
C4  -39.37,-212.73 0 top  (outside the outline)
C5  -8.89,-196.85 0 top  (outside the outline)
C6  50.16,34.29 0 top
C7  45.72,34.92 270 top
C8  44.45,38.73 180 top
C10  71.76,44.81 0 top
C11  -26.67,-238.12 0 top  (outside the outline)
C12  -20.95,-238.12 0 top  (outside the outline)
C13  28.58,12.07 270 top
C14  39.37,38.73 0 top
C15  18.42,12.07 270 top
C16  8.89,9.53 90 top
C17  42.54,34.92 90 top
C21  -27.94,-75.56 0 top  (outside the outline)
C22  -39.37,-81.92 0 top  (outside the outline)
C23  6.05,26.06 180 top
C24  6.05,28.42 180 top
C25  -39.37,-75.56 0 top  (outside the outline)
C26  -20.95,-63.5 0 top  (outside the outline)
C27  4.45,9.53 270 top
C28  -39.37,-231.78 0 top  (outside the outline)
C29  -39.37,-253.37 0 top  (outside the outline)
C32  -39.37,-288.93 0 top  (outside the outline)
C34  20.98,38.66 90 top
C35  -39.37,-295.28 0 top  (outside the outline)
C41  -39.37,-301.62 0 top  (outside the outline)
C42  -39.37,-307.98 0 top  (outside the outline)
C43  13.92,41.78 180 top
C44  -39.37,-314.32 0 top  (outside the outline)
C45  -39.37,-320.68 0 top  (outside the outline)
C46  -39.37,-327.03 0 top  (outside the outline)
C47  -39.37,-333.38 0 top  (outside the outline)
C48  -37.47,-346.07 0 top  (outside the outline)
C49  -39.37,-352.43 0 top  (outside the outline)
C50  -39.37,-358.78 0 top  (outside the outline)
C51  -39.37,-365.12 0 top  (outside the outline)
D1  75.39,39.29 0 top
D2  -37.47,-409.57 0 top  (outside the outline)
D3  9.53,45.09 90 top
FAN  4.45,45.09 270 top
FRONTLIGHT  77.47,17.78 90 top
GND  13.97,33.02 0 bottom
I2C  59.69,40.01 0 top
IC1  -34.29,-166.37 0 top  (outside the outline)
IC2  67.95,20.96 90 top
INA219  10.16,30.76 0 top
J1  -31.75,-397.51 0 top  (outside the outline)
LDIAR  77.47,30.48 90 top
LED1  26.37,38.23 0 top
LIDAR_MOTOR  77.47,44.45 90 top
M1  69.85,39.37 180 top
M2  12.8,46.66 0 top
M3  78.11,12.07 0 top
P1  -27.94,-183.52 0 top  (outside the outline)
P2  50.16,8.89 0 top
P3  -27.94,-200.66 0 top  (outside the outline)
P4  -27.94,-142.88 0 top  (outside the outline)
PCA9533  15.24,34.29 180 top
PWR  5.71,18.41 270 top
R1  -40.01,-370.84 0 top  (outside the outline)
R2  -40.01,-375.92 0 top  (outside the outline)
R3  77.6,22.58 180 top
R4  -40.01,-386.08 0 top  (outside the outline)
R5  26.39,40.28 180 top
R6  78,8.92 180 top
R7  -28.57,-243.84 0 top  (outside the outline)
R8  -24.13,-243.84 0 top  (outside the outline)
R9  -40.01,-87.63 0 top  (outside the outline)
R10  -40.01,-381 0 top  (outside the outline)
R11  -40.01,-92.71 0 top  (outside the outline)
R12  -40.01,-405.76 0 top  (outside the outline)
R13  -40.01,-97.79 0 top  (outside the outline)
R14  -41.27,-413.38 0 top  (outside the outline)
R15  -40.01,-283.21 0 top  (outside the outline)
R16  -41.27,-418.47 0 top  (outside the outline)
R17  12.7,10.92 270 top
R18  -41.27,-423.55 0 top  (outside the outline)
R19  -41.27,-428.62 0 top  (outside the outline)
R20  -41.27,-433.71 0 top  (outside the outline)
R22  15.65,46.33 90 top
R25  41.53,23.88 0 top
R26  9.53,39.37 180 top
R27  9.53,37.16 180 top
R28  9.53,34.92 180 top
R34  2.49,25.55 270 top
R35  2.51,29.21 270 top
R38  66.85,39.55 90 top
RGB_LED  4.45,36.2 270 top
RPI_ZERO  42.6,44.88 180 top
SJ1  -38.73,-154.94 0 top  (outside the outline)
U1  31.75,22.86 0 top
U3  50.16,38.1 270 top
U5  59.21,22.05 90 top
X1  -24.76,-219.71 0 top  (outside the outline)

### Tracks (layer width: path | path; a pad name or v marks a point on that pad's centre or on a via)
+1.8V
  Top 0.203: U3.8 45.88,38.7
  Top 0.254: C8.1 45.88,38.7
  Top 0.61: 1.8V_CONV.2 37.79,38.56 arc-90 C14.1 39.88,40.64 43.95,40.64 C8.1
+3V3  (via drill 0.35)  (33 unrouted)
  Top 0.254: U3.13 49.16,34.69 C6.1
  Top 0.406: C24.1 7.44,29.52 v8.1,30.17 8.66,30.73 10.46,30.73 arc-90 11.13,30.06 INA219.4 | 22.96,17.88 22.86,17.78 | v43.48,21.69 43.23,21.72 40,21.72 | v18.82,22.86 17.83,23.85 16.79,23.85 15.24,25.4 13.23,25.4 12.08,26.55 | C6.1 48.77,32.89 46.99,31.12 42.54,31.12
  Top 0.508: PCA9533.8 v17.15,29.21 17.15,27.8
  Top 0.61: v43.48,21.69 43.48,23.88 | 43.48,23.88 43.48,24.99 44.17,25.68 44.17,27.58 43.22,28.53 42.54,28.53 | R25.2 43.48,23.88 | 19.91,18.01 19.69,17.78 | 42.54,28.53 40.55,28.53 | 42.54,28.53 42.54,31.12 C17.1 arc-90 42.47,33.45 39.45,33.45 arc-90 38.73,34.16 1.8V_CONV.3
  Top 0.813: 28.58,15.24 v29.85,15.24 | v56.52,11.43 45.09,11.43 44.3,10.64 41.35,10.64 arc-90 38.71,13.28 v38.71,13.49
  Top 1.016: C23.1 C24.1 | C13.1 28.58,15.24 28.58,15.88 26.67,17.78 23.5,17.78 | 23.5,17.78 22.86,17.78 19.69,17.78 19.08,17.78 18.31,18.54 18.31,22.35 v18.82,22.86 | 3.3V_CONV.2 23.5,17.78
  Bottom 0.508: v17.15,29.21 3.3V.TP 9.07,29.21 v8.1,30.17
  Bottom 0.61: 59.51,14.43 v56.52,11.43
  Bottom 0.813: v43.48,21.69 43.48,17.45 39.52,13.49 v38.71,13.49 31.06,13.49 29.85,14.71 v29.85,15.24 | v18.82,22.86 18.82,24.56 17.15,26.24 v17.15,29.21
  other vias: 59.51,22.68
  pour Top (isolate 0.406, rank 2, no thermals): 21.59,10.16 19.05,7.62 19.05,6.99 16.51,0 29.85,0 29.85,7.62 27.94,7.62 25.4,10.16
+5V  (via drill 0.35, 0.5 pad 1.3)  (5 unrouted)
  Top 0.406: 18.47,46.05 RPI_ZERO.40 19.74,44.88 | RPI_ZERO.38 19.74,44.88 | 19.74,44.88 19.74,42.65 arc90 20.17,42.22 20.37,42.22 arc-90 20.98,41.61 C34.+ 21.08,40.28 R5.2
  Top 0.508: R3.1 78.45,23.79 77.42,24.81 LDIAR.P5
  Top 0.813: 75.08,26.09 75.23,26.24 75.18,25.65 | 36.14,9.58 35.56,10.16 34.52,10.16
  Top 1.016: I2C.4 63.5,37.47 64.77,36.2 78.49,36.2 79.43,35.26 79.43,27.81 arc-90 78.16,26.54 77.48,26.54 arc90 LDIAR.P5 | 76.71,26.54 77.36,26.54 LDIAR.P5 | LDIAR.P5 76.7,26.48 | 76.65,26.48 LDIAR.P5
  Top 1.27: LDIAR.P5 76.01,26.48 arc90 75.18,25.65 75.18,7.85 arc-90 73.69,6.35 35.56,6.35 34.52,7.39 34.52,10.16 34.52,15.9 arc90 33.02,17.4 5V_CONV.OUT+ | C15.1 v18.42,15.24 18.44,15.21 3.3V_CONV.3
  Bottom 0.813: LDIAR.P5 60.16,26.48
  Bottom 1.27: v18.42,15.24 18.42,17.14 19.72,18.45
  Bottom 1.778: RPI_ZERO.38 RPI_ZERO.40 15.04,46.15 10.16,41.27 10.16,37.47 5.91,33.22 RGB_LED.P1 4.49,28.65 6.38,26.77 9.07,26.77 10.16,25.68 14.67,25.68 17.15,23.21 17.15,21.03 19.72,18.45 20.78,17.4 5V_CONV.OUT+
  other vias: 58.29,24.61
+8V  (via drill 0.35, 0.5 pad 1.3)  (8 unrouted)
  Top 0.406: INA219.2 9.83,27.03 12.17,24.69 14.69,24.69 16.28,23.1 16.28,20.32 15.01,19.05 13.33,19.05 12.06,17.78 12.06,16.51 13.78,14.8 | R17.1 13.78,14.8 | 13.78,14.8 5V_CONV.IN+
  Top 0.813: 77.34,45.44 LIDAR_MOTOR.P1 76.01,45.52 | 43.16,13.18 v43.13,13.16 | D1.C 73.34,44.66 C10.+
  Top 1.016: FAN.P1 8.58,44.01 D3.C 9.53,42.76 10.5,41.78 C43.+ | 40.49,12.85 arc90 41.27,12.07 42.04,12.07 arc90 43.16,13.18 | v57.63,8.69 59.01,8.69 | C10.+ 75.29,44.81 76.01,45.52 77.25,45.52 77.34,45.44
  Bottom 0.61: 16.41,13.87 16.41,17.37 arc90 5V_CONV.IN+
  Bottom 1.27: v43.13,13.16 42.04,12.07 40,12.07 40,11.43
  Bottom 1.778: LIDAR_MOTOR.P1 74.49,45.52 71.77,48.25 11.86,48.25 7.62,44.01 FAN.P1 3.37,44.01 1.91,42.55 1.91,27.3 5.08,24.13 7.62,24.13 9.53,22.23 9.53,19.69 11.81,17.4 5V_CONV.IN+ | 41.27,11.43 40,11.43 40,11.05 41.85,11.05 arc-90 43.18,9.72 43.18,8.25 arc90 45.09,6.35 55.3,6.35 arc90 v57.63,8.69
  Bottom 2.54: 40,11.43 18.85,11.43 arc-90 16.41,13.87
  pour Top (isolate 0.406, rank 2, no thermals): 11.3,14.55 15.42,18.19 17.2,16.41 14.27,13
  pour Bottom (isolate 0.152, no thermals): 15.47,16.46 15.21,13.89 17.6,13.97 17.3,16.46
BAT_LVL  (via drill 0.35)  (1 unrouted)
  Top 0.305: 29.64,24.03 29.92,23.75 29.92,22.73 29.41,22.23 v28.35,22.23 | 2.49,27.3 1.91,27.3 1.27,27.94 1.27,33.02 2.46,34.21 7.59,34.21 7.87,33.93 16.48,33.93 16.64,33.78 v17.4,33.78
  Top 0.508: R34.1 2.49,27.3 2.49,28.31 R35.2
  Bottom 0.406: v28.35,22.23 27.08,20.96 26.04,20.96 21.08,25.91 20.62,25.91 18.24,28.3 18.24,32.94 v17.4,33.78
DEC_LB_1  (1 unrouted)
DEC_LB_2  (1 unrouted)
DEC_LF_1  (1 unrouted)
DEC_LF_2  (1 unrouted)
DEC_RB_1  (1 unrouted)
DEC_RB_2  (1 unrouted)
DEC_RF_1  (1 unrouted)
DEC_RF_2  (1 unrouted)
GND  (via drill 0.35, 0.5 pad 1.3)  (67 unrouted)
  Top 0.254: 49.05,43.51 RPI_ZERO.15 | C14.2 C8.2 | U3.18 51.16,34.69 C6.2 53.98,34.29
  Top 0.305: 36.66,28.03 36.47,28.23 36.47,28.81 36.67,29.01 38,29.01 v38.46,29.46 | 38.58,18.57 arc-90 v38.1,18.41 | 37.46,18.41 v38.1,18.41 | 37.49,18.41 v38.1,18.41 | 50.93,26.8 51.1,26.62 51.1,25.83 50.62,25.35 47.62,25.35 46.99,25.98 46.99,29.84 49.53,32.38 53.34,32.38 53.98,33.02 53.98,34.29 53.98,34.92 55.24,36.2 59.69,36.2 | v38.1,18.41 36.68,18.41 35.32,19.77
  Top 0.406: 60.96,38.1 59.69,36.83 59.69,36.2 59.69,35.96 62.86,32.79 62.86,32.38 63.5,31.75 65.62,31.75 | v38.46,29.46 38.46,30.84 38.73,31.12 | 38.73,31.12 38.86,31.24 | C7.2 44.71,34.16 C17.2 | 1.8V_CONV.1 38.63,35.56 38.1,35.56 37.46,34.92 37.46,32.38 38.73,31.12 | M1.2 66.73,42.64 RPI_ZERO.1 | 20.32,33.66 19.69,33.02 19.69,25.3 20.35,24.64 23.83,24.64 | 20.32,33.66 21.71,33.66 | 20.32,33.66 v19.69,34.29 | INA219.8 9.19,32.88 9.53,33.22 9.83,32.91 INA219.7 | INA219.3 10.48,28.25 v10.82,27.91 | LED1.1 25.37,36.99 25.4,36.96
  Top 0.508: RPI_ZERO.1 65.46,44.88 60.38,44.88 RPI_ZERO.8 57.84,44.88 55.3,44.88 RPI_ZERO.12 52.76,44.88 50.22,44.88 RPI_ZERO.15 47.68,44.88 42.6,44.88 RPI_ZERO.22 | RPI_ZERO.28 32.44,44.88 29.9,44.88 RPI_ZERO.31 27.33,44.91 24.79,44.91 RPI_ZERO.36 | C34.- 20.98,36.86 | 13.35,38.73 PCA9533.4 13.35,38.74 15.19,40.59 C43.- 15.19,42.59 13.75,44.03 M2.2 | 31.62,14.83 v31.88,14.83 30.72,15.99 30.71,15.99 30.47,16.23 30.47,16.24 27.16,19.55 | M3.2 79.06,11.11 79.68,11.73 79.68,14.76 v79.17,15.27 | 9.53,33.22 8.81,33.22 v7.77,32.18
  Top 0.61: v12.7,39.37 13.32,38.74 13.35,38.74 | 43.59,18.41 43.59,17.37 43.97,16.99 | 43.59,18.41 43.59,19.69 | 43.74,19.53 43.59,19.69 | 43.74,18.26 43.59,18.41 | 43.74,20.8 43.59,20.65 43.59,19.69 | 40.49,18.26 arc-90 40.64,18.41 | 1.8V_CONV.1 39.67,37.64 C14.2 40.77,38.1 C17.2 | RPI_ZERO.31 29.85,42.39 29.85,36.33 | C34.- 25.4,36.96 29.22,36.96 | PWR.2 8.37,15.28 9.55,16.46 9.55,22.3 7.75,24.11 6.96,24.11 6.1,24.97 6.1,29.59 6.65,30.15 v6.73,30.15
  Top 0.813: 4.59,27.1 C24.2 4.64,30.05 4.63,30.06 R35.1 | C16.2 5.1,10.93 C27.- 5.08,12.7 5.71,13.34 PWR.2 | I2C.3 60.96,38.1 64.14,34.92 67.54,34.92 68.58,33.88 | LDIAR.P4 77.33,28.58
  Top 1.016: C23.2 C24.2 | 5V_CONV.IN- 18.42,10.03 C15.2 | 31.88,10.8 31.75,10.66 C13.2 26.44,10.66 25.8,11.31 3.3V_CONV.1 | C10.- 68.68,44.81 68.3,44.42 68.3,43.69 68.22,43.61 RPI_ZERO.1 | v19.43,38.1 19.48,36.96 C34.-
  Top 1.27: 5V_CONV.IN- 16.51,8.12 | C23.2 4.59,24.62 6.35,22.86 7.26,22.86 8.26,21.87 8.26,17.78 6.39,15.91 PWR.2 | v38.1,18.41 40.64,18.41 43.59,18.41 | v7.77,32.18 6.55,32.18 4.64,30.27 C24.2
  Top 1.778: 5V_CONV.OUT- 31.88,10.8 v31.88,14.83
  Bottom 0.305: 32.35,8.47 5V_CONV.OUT-
  Bottom 0.406: v10.82,27.91 10.41,28.32 7.09,28.32 6.07,29.34 6.07,30.48 v7.77,32.18
  Bottom 0.61: v38.46,29.46 38.48,29.46 39.37,28.58 | v12.7,39.37 13.97,38.1 | RPI_ZERO.1 65.18,42.06 60.96,42.09 I2C.3 | 79.53,28.58 79.53,19.53 79.63,19.43 79.63,15.72 v79.17,15.27 | v19.69,34.29 19.05,34.92 16.71,34.92 16.33,34.54 16.33,32.21 15.16,31.04 7.62,31.04 v6.73,30.15
  Bottom 0.813: 73.03,35.56 73.16,35.69 78.58,35.69 79.53,34.74 79.53,28.58 79.43,28.48 LDIAR.P4 | 5V_CONV.OUT- 33.53,6.35 40.64,6.35 41.27,6.99 | GND.TP 11.29,35.7
  Bottom 1.27: v31.88,14.83 33.25,14.83 36.5,18.09 | RPI_ZERO.1 68.15,43.61 73.03,38.73 73.03,35.56 73.03,35.13 68.38,30.48 48.13,30.48 46.22,28.58 39.37,28.58 36.5,25.7 36.5,18.09 | v19.43,38.1 13.97,38.1 13.69,38.1 11.29,35.7 v7.77,32.18 | v38.1,18.41 36.83,18.41 36.5,18.09
  Bottom 2.54: 5V_CONV.OUT- 5V_CONV.IN- 13.63,8 PWR.2
  pour Top (isolate 0.254, rank 3): -1.27,50.8 -1.27,-0.64 81.92,-0.64 81.92,50.8
  pour Bottom (isolate 0.254, rank 3): -2.54,-1.91 -2.54,52.07 83.19,52.07 83.19,-1.91
  cutout Top: 52.7,41.27 47.62,41.27 arc90 46.99,40.64 46.99,35.56 arc90 47.62,34.92 52.7,34.92 arc90 53.34,35.56 53.34,40.64 arc90
  cutout Bottom: 53.34,36.2 53.34,40.64 arc90 52.7,41.27 47.62,41.27 arc90 46.99,40.64 46.99,36.2 arc90 47.62,34.92 52.7,34.92 arc90
  cutout Top: 18.42,35.56 18.54,35.23 30.61,35.23 30.48,35.56
  cutout Bottom: 7.26,31.75 14.71,31.75 15.62,32.66 15.62,34.87 16.28,35.53 19.69,35.53 20.55,34.67 20.55,33.83 20.17,33.45 19.28,33.45 18.92,33.81 18.92,34.01 18.75,34.19 17.22,34.19 17.07,34.04 17.07,32.26 17.09,32.23 17.09,31.98 15.47,30.35 8.05,30.35 7.04,29.34 6.48,29.34 5.99,29.82 5.99,30.48
  cutout Top: 6.38,30.81 5.31,29.74 5.31,24.74 6.71,23.34 7.65,23.34 8.84,22.15 8.84,17.4 7.98,16.43 7.75,16.15 7.32,14.94 7.62,14.61 8.79,14.61 10.44,16.26 10.44,22.61 8.13,24.92 7.24,24.92 6.83,25.32 6.83,29.21 7.39,29.77 7.44,29.77 7.44,30.56 7.47,30.58 7.24,30.81
I2C1_SCL  (4 unrouted)
I2C1_SDA  (4 unrouted)
I2C3_SCL  (2 unrouted)
I2C3_SDA  (2 unrouted)
LIDAR_POS_INT  (via drill 0.35)  (1 unrouted)
  Top 0.305: 38.36,23.03 v39.12,22.28
  Bottom 0.406: LDIAR.P3 71.76,30.48 69.47,28.19 49.17,28.19 45.64,24.66 41.3,24.66 40.06,25.91 38.76,25.91 37.9,25.04 37.9,23.5 v39.12,22.28
M_LB_IN1  (1 unrouted)
M_LB_IN2  (1 unrouted)
M_LF_IN1  (1 unrouted)
M_LF_IN2  (1 unrouted)
M_PWM_LB  (2 unrouted)
M_PWM_LF  (2 unrouted)
M_PWM_RB  (2 unrouted)
M_PWM_RF  (2 unrouted)
M_RB_IN1  (1 unrouted)
M_RB_IN2  (1 unrouted)
M_RF_IN1  (1 unrouted)
M_RF_IN2  (1 unrouted)
M_SLEEP  (2 unrouted)
N$1  (1 unrouted)
N$2  (1 unrouted)
N$3  (1 unrouted)
N$4  (1 unrouted)
N$5  (2 unrouted)
N$6
  Top 0.508: R3.2 76.75,21.04 77.47,20.32 77.47,18.9 FRONTLIGHT.P1
N$7
  Top 0.406: LED1.2 27.37,40.16 R5.1
N$8
  Top 0.203: U3.10 48.06,37.9 arc90 47.62,37.47 47.62,36.91 arc-90 47.07,36.35 45.74,36.35 arc90 C7.1
  Top 0.254: 45.85,36.96 C7.1
N$9
  Top 0.508: FRONTLIGHT.P2 77.42,15.92 78.11,15.24 M3.3
N$10  (1 unrouted)
  Top 0.61: R6.2 arc90 R6.2 M3.1
N$11  (1 unrouted)
N$12  (1 unrouted)
N$13  (2 unrouted)
N$14  (2 unrouted)
N$15  (1 unrouted)
N$16  (1 unrouted)
N$17  (1 unrouted)
N$18  (1 unrouted)
N$19  (1 unrouted)
N$20  (1 unrouted)
N$21  (1 unrouted)
N$22
  Top 0.406: PCA9533.3 14.62,36.2 arc-45 14.53,35.99 arc-45 14.16,35.84 12.93,35.84 11.94,36.83 11.94,37.81 R26.1
  Top 0.508: 10.38,39.18 R26.1
N$23
  Top 0.406: R27.1 10.49,37.16 12.47,35.18 14.26,35.18 arc45 15.67,35.76 arc45 15.88,36.28 PCA9533.2
N$24
  Top 0.406: R28.1 10.73,34.57 16.15,34.57 17.15,35.56 PCA9533.1
  Top 0.508: 10.59,34.92 R28.1
N$25  (1 unrouted)
N$26  (1 unrouted)
N$27  (1 unrouted)
N$28  (1 unrouted)
N$29  (1 unrouted)
N$30  (1 unrouted)
N$31
  Top 0.406: RGB_LED.P4 8.52,39.22 R26.2
N$32  (4 unrouted)
N$33
  Top 0.406: RGB_LED.P3 8.62,37.22 R27.2
  Top 0.508: 8.54,37.29 R27.2
N$34  (1 unrouted)
N$35
  Top 0.406: RGB_LED.P2 6.06,35.22 6.35,34.92 R28.2
N$36  (1 unrouted)
N$37  (1 unrouted)
  Top 0.406: 15.43,47.18 R22.2 13.92,47.18 13.45,46.7 13,46.7 M2.1
N$38  (1 unrouted)
  Top 0.406: R38.2 66.92,40.4 67.95,39.37 69.85,39.37 70.8,40.32 M1.1
N$39
  Top 0.813: LIDAR_MOTOR.P2 77.44,43.51 D1.A 75.61,37.47 70.66,37.47 M1.3
N$40  (5 unrouted)
N$44  (1 unrouted)
N$45  (1 unrouted)
N$55
  Top 0.813: 9.89,47.5 D3.A 12.18,47.13 M2.3 | 9.07,46.36 8.73,46.01
  Top 1.016: 9.58,46.86 D3.A 9.53,46.8 8.73,46.01 FAN.P2
NFAULT  (3 unrouted)
NRST  (via drill 0.35)  (3 unrouted)
  Top 0.305: 26.62,25.53 v26.24,25.15
  Top 0.406: v26.24,25.15 25.12,24.03 24.53,24.03
  Bottom 0.305: v26.24,25.15 28.07,26.98 28.07,29.67 30.23,31.83 30.23,40.39 31.75,41.91 | RPI_ZERO.26 34.98,44.88 34.98,42.82 34.06,41.91 31.75,41.91 | 29.85,41.91 31.75,41.91
PWM_FAN  (via drill 0.35)  (1 unrouted)
  Top 0.305: v32.82,19.64 v32.82,19.63
  Top 0.406: R22.1 15.65,44.37 18.31,41.71 18.31,26.77 v18.67,26.42
  Bottom 0.406: v32.82,19.63 arc-90 32.03,18.85 22.02,18.85 20.02,20.85 20.02,25.07 v18.67,26.42
PWM_LIDAR  (via drill 0.35)  (1 unrouted)
  Top 0.305: 33.32,22.53 33.66,22.86 v34.29,22.86
  Top 0.406: R38.1 66.82,38.73 66.04,38.73 65.51,38.2 v65.51,37.36
  Bottom 0.406: v34.29,22.86 35.51,24.08 35.51,26.12 36.85,27.46 36.85,29.08 38.03,30.25 46.5,30.25 47.72,31.47 62.59,31.47 65.51,34.39 v65.51,37.36
PWM_LIGHT  (via drill 0.35)  (1 unrouted)
  Top 0.305: 38.83,24.03 v40.34,22.53
  Top 0.406: v76.84,6.99 78.11,6.99 78.85,7.73 R6.1
  Bottom 0.406: v40.34,22.53 38.69,24.18 38.69,24.84 39.12,25.27 39.73,25.27 41.02,23.98 46,23.98 49.55,27.53 53.29,27.53 57.23,23.6 61.62,23.6 63.5,25.48 67.11,25.48 69.95,22.63 73.76,22.63 74.93,21.46 74.93,8.89 v76.84,6.99
SWCLK  (1 unrouted)
  Top 0.305: RPI_ZERO.20 42.39,47.62 38.51,47.62 37.46,46.58 37.46,41.91 35.82,40.27
SWDIO  (1 unrouted)
  Top 0.305: RPI_ZERO.24 40.08,44.86 40.08,42.62 39.01,41.55 38.38,41.55 36.58,39.75 36.58,29.66 35.94,29.02 35.94,27.99 36.4,27.53
TEMPERATURE  (via drill 0.35)  (3 unrouted)
  Top 0.305: v39.42,24.54 v39.41,24.53 40.02,24.53 R25.1
  Top 0.406: v57.6,15.22 v57.61,15.21
  Bottom 0.406: v39.42,24.54 40.77,23.19 46.2,23.19 49.84,26.82 52.93,26.82 | 57.61,22.15 v57.61,15.21
UART4_RX  (via drill 0.35)  (1 unrouted)
  Top 0.305: 30.32,20.52 arc-90 29.95,20.14 28.98,20.14 v27.03,22.1
  Bottom 0.305: RPI_ZERO.34 26.09,45.77 24.77,44.45 24.77,41.91 29.11,37.57 29.11,32.21 27,30.1 27,27.79 24.84,25.63 24.84,24.28 v27.03,22.1
UART4_TX  (via drill 0.35)  (1 unrouted)
  Top 0.305: v27.24,23.03 v27.23,23.04
  Bottom 0.305: RPI_ZERO.32 27.33,44.86 27.33,42.72 29.64,40.41 29.64,31.95 27.51,29.82 27.51,27.51 25.4,25.4 25.4,24.77 27.13,23.04 v27.23,23.04
USART3_RX  (via drill 0.35)
  Top 0.305: 38.73,26.03 39.37,26.67 41.91,26.67 v42.54,27.3
  Bottom 0.406: LDIAR.P1 73.95,34.48 68.96,29.49 48.54,29.49 46.35,27.3 v42.54,27.3
USART3_TX  (via drill 0.35)
  Top 0.305: 38.97,25.53 39.5,26.06 42.82,26.06 v43.18,26.42
  Bottom 0.406: 48.87,28.83 48.89,28.83 | 48.89,28.83 69.22,28.83 72.87,32.48 LDIAR.P2 | 48.89,28.83 46.48,26.42 v43.18,26.42
USB_OTG_DM  (1 unrouted)
USB_OTG_DP  (1 unrouted)
USB_OTG_ID  (1 unrouted)
V+
  Top 0.406: INA219.1 9.19,24.47 10.49,23.16 10.49,8.12 | PWR.1 2.54,17.11 2.54,8.89 3.33,8.1 C27.+ 5.1,8.12 C16.1 10.49,8.12 | 10.49,8.12 R17.2
  Top 0.61: R34.2 2.49,23.5 2.5,23.5 PWR.1
  pour Top (isolate 0.406, rank 2, no thermals): 5.05,21.41 3.56,19.44 arc45 1.14,12.44 1.3,9.63 arc45 2.14,7.56 arc49 4.99,6.6 11.23,7.37 11.1,8.86 6.48,8.95 arc-17 4.51,9 arc-71 3.55,9.48 3.52,13.5 arc-42 5.56,18.85 6.48,20.6
(copper drawn outside any net)
  shapes: Top area x2

### Text on the board
tNames: + | - + | - | 5v I1 I2 GND
bNames: 5v GND SDA SCL | ζ2 Motherboard